# EAGLE design BR86_MKL_33961_Lichtplatine_vorne_J0_005_03_04 (EAGLE 5.10)
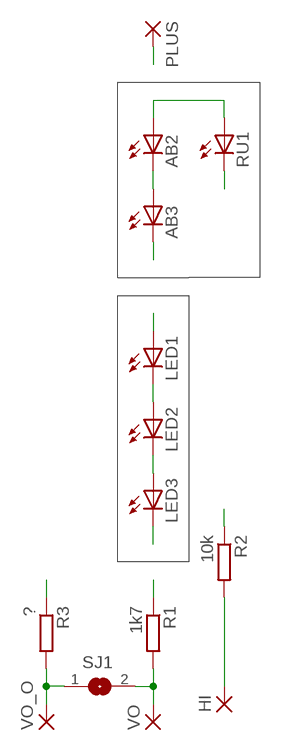
[diagram p0: schematic, sheet 1]

## Parts
AB2  LEDCHIP-LED0603  [CHIP-LED0603]
AB3  LEDCHIP-LED0603  [CHIP-LED0603]
HI  SMD2  [SMD1,27-2,54]
LED1  LEDCHIPLED_0603-JP  [CHIPLED-0603-JP]
LED2  LEDCHIPLED_0603-JP  [CHIPLED-0603-JP]
LED3  LEDCHIPLED_0603-JP  [CHIPLED-0603-JP]
PLUS  SMD2  [SMD1,27-2,54]
R1  1k7  R-EU_R0603  [R0603]
R2  10k  R-EU_R0603  [R0603]
R3  ?  R-EU_R0603  [R0603]
RU1  LEDCHIP-LED0603  [CHIP-LED0603]
SJ1  SJSS  [SJSS]
VO  SMD2  [SMD1,27-2,54]
VO_O  SMD2  [SMD1,27-2,54]

## Nets
N$1: AB2.C AB3.A
N$2: R1.2 SJ1.2 VO.1(P)
N$3: LED3.C
N$4: AB3.C
N$5: AB2.A RU1.A
N$6: HI.1(P) R2.2
N$10: R3.2 SJ1.1 VO_O.1(P)
N$12: R3.1
N$13: RU1.C
N$14: LED1.A
N$15: R2.1
N$17: R1.1
N$19: LED1.C LED2.A
N$20: LED2.C LED3.A
PLUS: PLUS.1(P)

## Library data of the parts
AB2 AB3 LED1-LED3 RU1 = led:LED: LED OSRAM: - CHIPLED LG R971, LG N971, LY N971, LG Q971, LY Q971, LO R971, LY R971 LH N974, LH R974 LS Q976, LO Q976, LY Q976 LO Q996 - Hyper CHIPLED LW Q18S LB Q993, LB Q99A, LB R99A - SideLED LS A670, LO A670, LY A670, LG A670, LP A670 LB A673, LV A673, LT A673, LW A673 LH A674 LY A675 LS A676, LA A676, LO A676, LY A676, LW A676 LS A679, LY A679, LG A679 - Hyper Micro SIDELED® LS Y876, LA Y876, LO Y876, LY Y876 LT Y87S - SmartLED LW L88C, LW L88S LB L89C, LB L89S, LG L890 LS L89K, LO L89K, LY L89K LS L896, LA L896, LO L896, LY L896 - TOPLED LS T670, LO T670, LY T670, LG T670, LP T670 LSG T670, LSP T670, LSY T670, LOP T670, LYG T670 LG T671, LOG T671, LSG T671 LB T673, LV T673, LT T673, LW T673 LH T674 LS T676, LA T676, LO T676, LY T676, LB T676, LH T676, LSB T676, LW T676 LB T67C, LV T67C, LT T67C, LS T67K, LO T67K, LY T67K, LW E67C LS E67B, LA E67B, LO E67B, LY E67B, LB E67C, LV E67C, LT E67C LW T67C LS T679, LY T679, LG T679 LS T770, LO T770, LY T770, LG T770, LP T770 LB T773, LV T773, LT T773, LW T773 LH T774 LS E675, LA E675, LY E675, LS T675 LS T776, LA T776, LO T776, LY T776, LB T776 LHGB T686 LT T68C, LB T68C - Hyper Mini TOPLED® LB M676 - Mini TOPLED Santana® LG M470 LS M47K, LO M47K, LY M47K Source: http://www.osram.convergy.de LUXEON: - LUMILED® LXK2-PW12-R00, LXK2-PW12-S00, LXK2-PW14-U00, LXK2-PW14-V00 LXK2-PM12-R00, LXK2-PM12-S00, LXK2-PM14-U00 LXK2-PE12-Q00, LXK2-PE12-R00, LXK2-PE12-S00, LXK2-PE14-T00, LXK2-PE14-U00 LXK2-PB12-K00, LXK2-PB12-L00, LXK2-PB12-M00, LXK2-PB14-N00, LXK2-PB14-P00, LXK2-PB14-Q00 LXK2-PR12-L00, LXK2-PR12-M00, LXK2-PR14-Q00, LXK2-PR14-R00 LXK2-PD12-Q00, LXK2-PD12-R00, LXK2-PD12-S00 LXK2-PH12-R00, LXK2-PH12-S00 LXK2-PL12-P00, LXK2-PL12-Q00, LXK2-PL12-R00 Source: www.luxeon.com KINGBRIGHT: KA-3528ASYC Source: www.kingbright.com
HI PLUS VO VO_O = wirepad:SMD2: SMD PAD
R1-R3 = rcl:R-EU_: RESISTOR, European symbol
SJ1 = jumper:SJ: SMD solder JUMPER

## Board
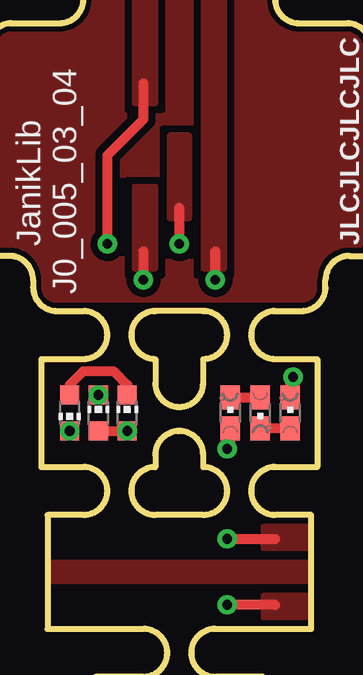
[diagram p1: board, top side]
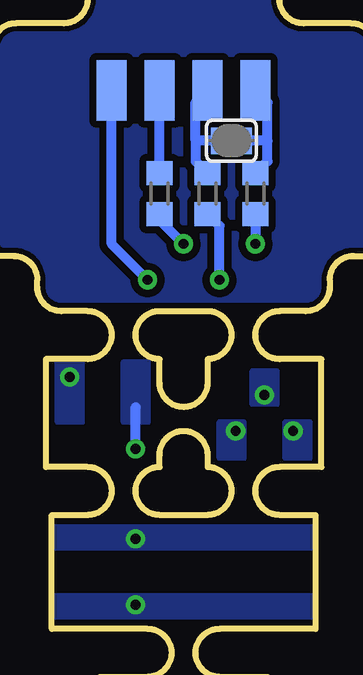
[diagram p2: board, bottom side, seen from below]

No outline drawn. Coordinates in mm, seen from the top.
Copper layers (1*16): Top 0.035mm / dielectric 1.5mm / Bottom 0.035mm
Design rules "default *": minimum track width 7mil, minimum drill 0.4mm, track to track 8mil, track to pad 8mil, pad to pad 8mil, via to via 8mil, smd to smd 8mil, copper to edge 40mil, drill to drill 8mil, minimum pad ring 10mil, minimum via ring 8mil, stop-mask expansion 4mil, vias tented up to drill 0mil, thermal gap 10mil
Milling: 70 lines

### Footprints (pad centres in the part's own frame; a part is rotated, then mirrored left to right if it is on the bottom)
CHIP-LED0603 = smd 0.8 x 0.8: A 0,-0.75; C 0,0.75
SMD1,27-2,54 = smd 1.27 x 2.54: 1 0,0
CHIPLED-0603-JP = smd 0.8 x 1: A 0,-0.65; C 0,0.65
R0603 = smd 1 x 1.1: 1 -0.85,0; 2 0.85,0
SJSS = smd 0.7 x 1.1: 1 -0.5,0; 2 0.5,0

### Placement (x,y rotation side)
AB2  5.83,-4.25 0 top
AB3  3.42,-4.25 180 top
HI  9,9.2 180 bottom
LED1  10.12,-4.25 0 top
LED2  11.38,-4.25 180 top
LED3  12.62,-4.25 0 top
PLUS  11,9.2 180 bottom
R1  7,4.9 90 bottom
R2  9,4.9 90 bottom
R3  5,4.9 90 bottom
RU1  4.62,-4.25 0 top
SJ1  6,7.1 180 bottom
VO  7,9.2 180 bottom
VO_O  5,9.2 0 bottom

### Tracks (layer width: path | path; a pad name or v marks a point on that pad's centre or on a via)
N$1
  Top 0.406: AB2.C 5.83,-3.08 5.25,-2.5 4,-2.5 3.42,-3.08 AB3.A
N$2
  Bottom 0.406: R1.2 7.5,6.25 7.5,7.1 | VO.1 7.5,8.7 7.5,7.1 | SJ1.2 7.5,7.1
N$3  (via drill 0.4)
  Top 0.406: LED3.C 12.62,-2.88 v12.75,-2.75
  pour Bottom (isolate 0.305): 12.25,-2.12 12.25,-4.62 13.25,-4.62 13.25,-2.12
N$4  (via drill 0.4)
  other vias: 3.42,-5
  pour Bottom (isolate 0.305): 2.75,-4.62 2.75,-6.12 3.75,-6.12 3.75,-4.62
N$5  (via drill 0.4)
  Top 0.406: RU1.A AB2.A
  other vias: 5.83,-5
  pour Bottom (isolate 0.305): 5.5,-4.62 5.5,-6.12 6.5,-6.12 6.5,-4.62
N$6
  Bottom 0.406: R2.2 HI.1
N$7
  pour Top (isolate 0.305, rank 3): 13.1,0.5 2.9,0.5 arc-90 2.4,1 2.4,1.3 arc90 0.9,2.8 0.5,2.8 0.5,11 arc-90 1,11.5 3,11.5 arc90 4.5,13 4.5,13.5 arc-90 6.5,15.5 9.5,15.5 arc-90 11.5,13.5 11.5,13 arc90 13,11.5 15,11.5 arc-90 15.5,11 15.5,2.8 15.1,2.8 arc90 13.6,1.3 13.6,1 arc-90
  pour Bottom (isolate 0.305, rank 3): 13.1,0.5 2.9,0.5 arc-90 2.4,1 2.4,1.3 arc90 0.9,2.8 0.5,2.8 0.5,11 arc-90 1,11.5 3,11.5 arc90 4.5,13 4.5,13.5 arc-90 6.5,15.5 9.5,15.5 arc-90 11.5,13.5 11.5,13 arc90 13,11.5 15,11.5 arc-90 15.5,11 15.5,2.8 15.1,2.8 arc90 13.6,1.3 13.6,1 arc-90
N$8
  pour Bottom (isolate 0.305): 11.5,-15.75 4.5,-15.75 4.5,-16.62 11.5,-16.62
N$9
  pour Top (isolate 0.305): 11.5,-17.25 4.5,-17.25 4.5,-18 11.5,-18
N$10
  Bottom 0.406: R3.2 4.5,6.25 4.5,7.1 | VO_O.1 4.5,8.7 4.5,7.1 | 4.5,7.1 SJ1.1
N$11
  pour Bottom (isolate 0.305): 11.5,-18.62 4.5,-18.62 4.5,-19.5 11.5,-19.5
N$12  (via drill 0.4)
  Top 0.406: v5,2.8 5,6.5 6.5,8 6.5,9.5
  Bottom 0.406: R3.1 v5,2.8
  pour Top (isolate 0.305): 6.12,13.68 6.12,8.68 7,8.68 7,13.68
N$13  (via drill 0.4)
  other vias: 4.62,-3.5
  pour Bottom (isolate 0.305): 4.12,-2.5 4.12,-3.88 5.12,-3.88 5.12,-2.5
N$14  (via drill 0.4)
  Top 0.406: LED1.A 10.12,-5.62 v10,-5.75
  Bottom 0.406: v10,-5.75 10,-4
  pour Bottom (isolate 0.305): 9.5,-2.12 9.5,-4.62 10.5,-4.62 10.5,-2.12
N$15  (via drill 0.4)
  Top 0.406: v8,2.8 8,4.3
  Bottom 0.406: v8,2.8 9,3.8 R2.1
  pour Top (isolate 0.305, rank 2): 7.62,7.3 7.62,3.9 8.38,3.9 8.38,7.3
N$17  (via drill 0.4)
  Top 0.406: v6.5,1.3 6.5,2.5
  Bottom 0.406: v6.5,1.3 6.5,3.55 R1.1
  pour Top (isolate 0.305): 6.12,5.17 6.12,1.77 7,1.77 7,5.17
N$19
  Top 0.406: LED1.C LED2.A
N$20
  Top 0.406: LED3.A LED2.C
N$201  (via drill 0.4)
  Top 0.406: v10,-9.5 12,-9.5
  pour Bottom (isolate 0.305): 13.5,-9 2.5,-9 2.5,-9.88 13.5,-9.88
  pour Top (isolate 0.305): 13.5,-9 11.5,-9 11.5,-9.88 13.5,-9.88
N$202
  pour Top (isolate 0.305): 13.5,-10.5 2.5,-10.5 2.5,-11.25 13.5,-11.25
N$203  (via drill 0.4)
  Top 0.406: 12,-12.25 v10,-12.25
  pour Bottom (isolate 0.305): 13.5,-11.88 2.5,-11.88 2.5,-12.75 13.5,-12.75
  pour Top (isolate 0.305): 13.5,-11.88 11.5,-11.88 11.5,-12.75 13.5,-12.75
PLUS  (via drill 0.4)
  Top 0.406: v9.5,1.3 9.5,2.5
  Bottom 0.406: v9.5,1.3 11,2.8 PLUS.1
  pour Top (isolate 0.305): 9,13.68 9,1.77 9.88,1.77 9.88,13.68

### Text on the board
tNames: JanikLib | JLCJLCJLCJLC | J0_005_03_04
bStop: BR86 LED | wo | wu | rt | + | Märklin 33961 | design by Janik Merz
Measures: Dicke = 1mm